# Altium schematic sheet P07_ BNO055 External.SchDoc
size 246 x 182 mm
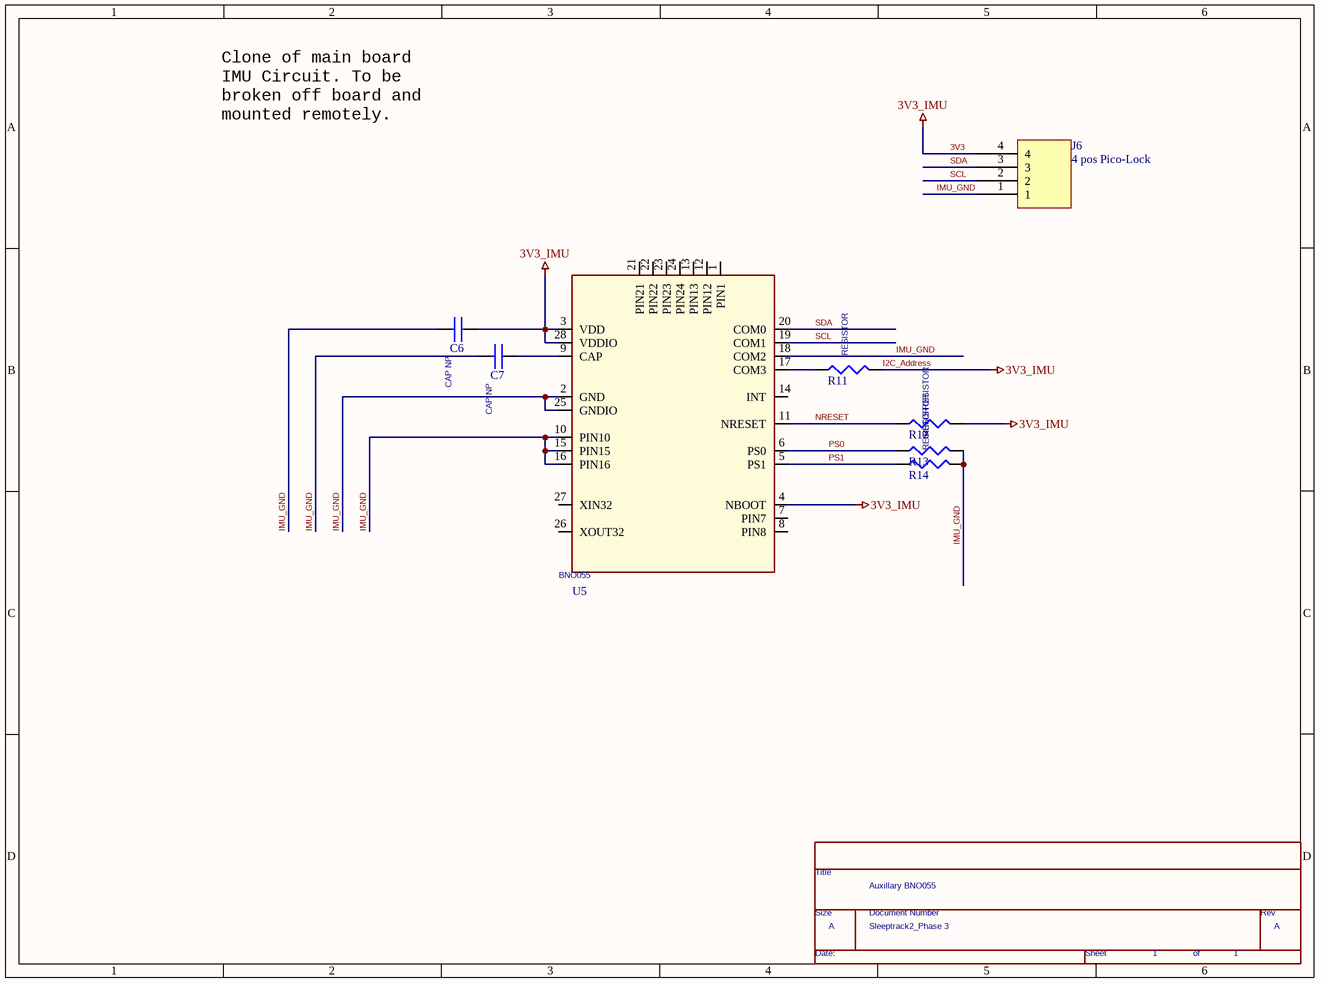
[diagram p0: P07_ BNO055 External.SchDoc]

## Parts
*  Doc: Sleeptrack2_Phase 3  RevCode: A  Title: Auxillary BNO055  Page Number: 1  (hidden comment: TitleBlock0)  (graphical)
C6  CAP NP
C7  CAP NP
J6  4 pos Pico-Lock  [5037630491]
R11  RESISTOR
R12  RESISTOR
R13  RESISTOR
R14  RESISTOR
U5  BNO055  [LCCS50P520X380X118-28N]

## Nets
3V3: C6.1 J6.4 R11.2 R12.2 U5.3(VDD) U5.4(NBOOT) U5.28(VDDIO)  [also labelled 3V3_IMU, I2C_Address]
IMU_GND: C6.2 C7.2 J6.1 R13.2 R14.2 U5.2(GND) U5.10(PIN10) U5.15(PIN15) U5.16(PIN16) U5.18(COM2) U5.25(GNDIO)
NRESET: R12.1 U5.11(NRESET)
PS0: R13.1 U5.6(PS0)
PS1: R14.1 U5.5(PS1)
SCL: J6.2 U5.19(COM1)
SDA: J6.3 U5.20(COM0)
NetC7_1: C7.1 U5.9(CAP)
NetR11_1: R11.1 U5.17(COM3)

Not connected (* = marked no-connect by the designer): J6 MH1(5) MH2(6); U5 1(PIN1) 7(PIN7) 8(PIN8) 12(PIN12) 13(PIN13) 14(INT) 21(PIN21) 22(PIN22) 23(PIN23) 24(PIN24) 26(XOUT32) 27(XIN32)

## Notes on the sheet
- Clone of main board
  IMU Circuit. To be
  broken off board and
  mounted remotely.
- (in symbol TitleBlock0) Title; Size; Document Number; Rev; Date:; Sheet; of

## Library data of the parts
J6 = 5037630491: 4 Positions Header, Shrouded Connector 0.039" (1.00mm) Surface Mount, Right Angle Gold
* = TitleBlock0: Page Create Date: March  8, 1995; Page Size: A; Page Count: 1